# Altium schematic sheet LittleRF_Hardware.SchDoc
size OrCAD C; SheetNumber: 1; SheetTotal: 1
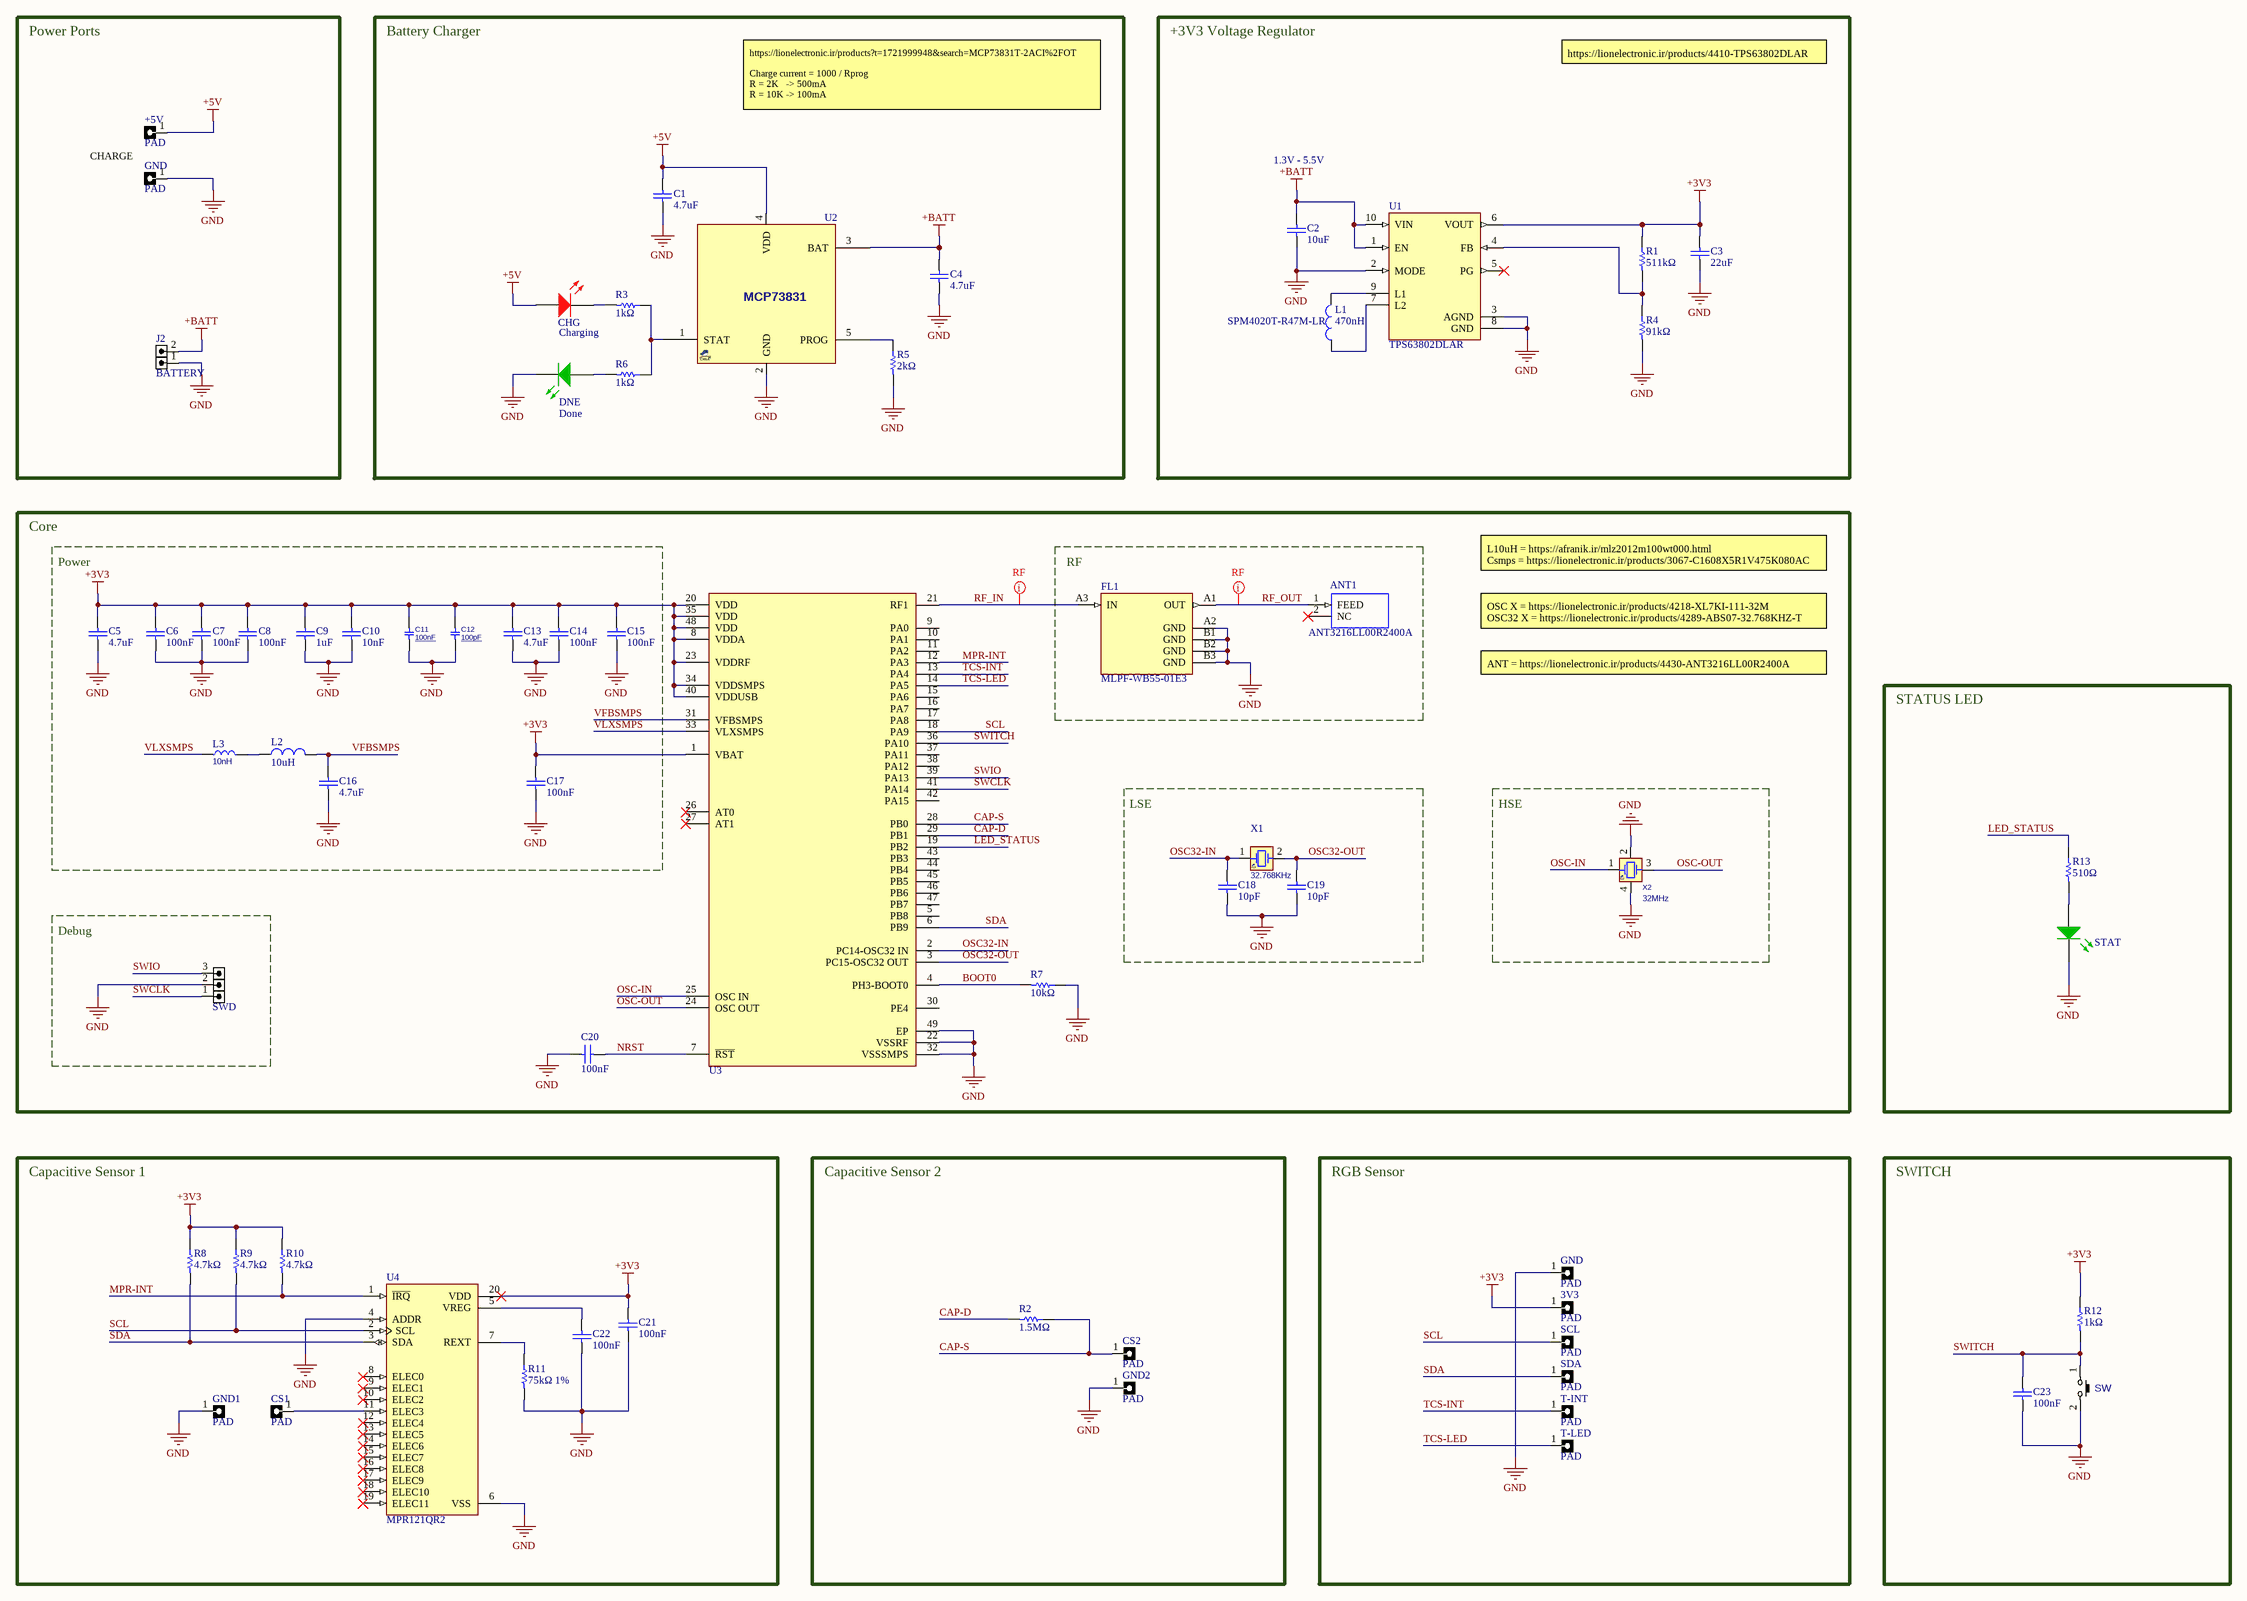
[diagram p0: LittleRF_Hardware.SchDoc]

## Parts
(Parts that share a designator on the sheet are numbered #1, #2 ... from top to bottom, then left to right.)
3V3  PAD  [HDR_F_1_Pad]
+5V  PAD  [HDR_F_1_Pad]
ANT1  ANT3216LL00R2400A  [ANTC3216X135N]
C1  4.7uF  [C0805]
C2  10uF  [C0805]
C3  22uF  [C0805]
C4  4.7uF  [C0805]
C5  4.7uF  [C0805]
C6  100nF  [C0603]
C7  100nF  [C0603]
C8  100nF  [C0603]
C9  1uF  [C0603]
C10  10nF  [C0603]
C11  100nF  [C0402]
C12  100pF  [C0402]
C13  4.7uF  [C0805]
C14  100nF  [C0603]
C15  100nF  [C0603]
C16  4.7uF  [C0805]
C17  100nF  [C0603]
C18  10pF  [C0603]
C19  10pF  [C0603]
C20  100nF  [C0603]
C21  100nF  [C0603]
C22  100nF  [C0603]
C23  100nF  [C0603]
CHG  LED-RED  [LEDSMD0603R]  (value not drawn)
CS1  PAD  [HDR_F_1_Pad]
CS2  PAD  [HDR_F_1_Pad]
DNE  LED-GREEN  [LEDSMD0603G]  (value not drawn)
FL1  MLPF-WB55-01E3  [FIL_MLPF-WB55-02E3]
GND1  PAD  [HDR_F_1_Pad]
GND2  PAD  [HDR_F_1_Pad]
GND#1  PAD  [HDR_F_1_Pad]
GND#2  PAD  [HDR_F_1_Pad]
J2  BATTERY  [HDR_M_1X2]
L1  470nH  [IND_SPM4020T-R47M-LR]
L2  10uH  [2012[0805]]
L3  10nH  [L0603]
R1  511kΩ  [1608[0603]]
R2  1.5MΩ  [1608[0603]]
R3  1kΩ  [1608[0603]]
R4  91kΩ  [1608[0603]]
R5  2kΩ  [1608[0603]]
R6  1kΩ  [1608[0603]]
R7  10kΩ  [1608[0603]]
R8  4.7kΩ  [1608[0603]]
R9  4.7kΩ  [1608[0603]]
R10  4.7kΩ  [1608[0603]]
R11  75kΩ 1%  [1608[0603]]
R12  1kΩ  [1608[0603]]
R13  510Ω  [1608[0603]]
SCL  PAD  [HDR_F_1_Pad]
SDA  PAD  [HDR_F_1_Pad]
STAT  LED-GREEN  [LEDSMD0603G]  (value not drawn)
SW  PUSHBUTTON  [SWPBS_SPDT_R_6X3X3.5]  (value not drawn)
SWD  HDRM3  [HDR_M_1X3]  (value not drawn)
T-INT  PAD  [HDR_F_1_Pad]
T-LED  PAD  [HDR_F_1_Pad]
U1  TPS63802DLAR  [VREG_TPS63802DLAR]
U2  MCP73831  [SOT23_5]  (value not drawn)
U3  STM32WB55CGU6  [STMicroelectronics_STM32WB55CGU6_IPC_B]  (value not drawn)
U4  MPR121QR2  [QFN40P300X300X60-20N]
X1  32.768KHz  [XTL_2_3215]
X2  32MHz  [XTL_4_2016]

## Blocks framed on the sheet
Power Ports: +5V GND#1 J2
Battery Charger: C1 C4 CHG DNE R3 R5 R6 U2
+3V3 Voltage Regulator: C2 C3 L1 R1 R4 U1
Core: C20 R7 U3
Power: C5-C17 L2 L3
RF: ANT1 FL1
STATUS LED: R13 STAT
LSE: C18 C19 X1
HSE: X2
Debug: SWD
Capacitive Sensor 1: C21 C22 CS1 GND1 R8-R11 U4
Capacitive Sensor 2: CS2 GND2 R2
RGB Sensor: 3V3 GND#2 SCL SDA T-INT T-LED
SWITCH: C23 R12 SW

## Nets
+3V3: 3V3.1 C3.2 C5.2 C6.2 C7.2 C8.2 C9.2 C10.2 C11.2 C12.2 C13.2 C14.2 C15.2 C17.2 C21.2 R1.1 R8.1 R9.1 R10.1 R12.1 U1.6(VOUT) U3.1(VBAT) U3.8(VDDA) U3.20(VDD) U3.23(VDDRF) U3.34(VDDSMPS) U3.35(VDD) U3.40(VDDUSB) U3.48(VDD) U4.20(VDD)
+5V: +5V.1 C1.2 CHG.1(A) U2.4(VDD)
+BATT: C2.2 C4.2 J2.2 U1.1(EN) U1.10(VIN) U2.3(BAT)
GND: C1.1 C2.1 C3.1 C4.1 C5.1 C6.1 C7.1 C8.1 C9.1 C10.1 C11.1 C12.1 C13.1 C14.1 C15.1 C16.1 C17.1 C18.1 C19.1 C20.1 C21.1 C22.1 C23.1 DNE.2(K) FL1.A2(GND) FL1.B1(GND) FL1.B2(GND) FL1.B3(GND) GND1.1 GND2.1 GND#1.1 GND#2.1 J2.1 R4.2 R5.2 R7.1 R11.2 STAT.2(K) SW.2 SWD.2 U1.2(MODE) U1.3(AGND) U1.8(GND) U2.2(GND) U3.22(VSSRF) U3.32(VSSSMPS) U3.49(EP) U4.4(ADDR) U4.6(VSS) X2.2 X2.4
BOOT0: R7.2 U3.4(PH3-BOOT0)
CAP-D: R2.2 U3.29(PB1)
CAP-S: CS2.1 R2.1 U3.28(PB0)
LED_STATUS: R13.1 U3.19(PB2)
MPR-INT: R10.2 U3.12(PA3) U4.1(~{IRQ})
NRST: C20.2 U3.7(~{RST})
OSC32-IN: C18.2 U3.2(PC14-OSC32_IN) X1.1(OSC1)
OSC32-OUT: C19.2 U3.3(PC15-OSC32_OUT) X1.2(OSC2)
OSC-IN: U3.25(OSC_IN) X2.1
OSC-OUT: U3.24(OSC_OUT) X2.3
RF_IN: FL1.A3(IN) U3.21(RF1)
RF_OUT: ANT1.1(FEED) FL1.A1(OUT)
SCL: R9.2 SCL.1 U3.18(PA9) U4.2(SCL)
SDA: R8.2 SDA.1 U3.6(PB9) U4.3(SDA)
SWCLK: SWD.1 U3.41(PA14)
SWIO: SWD.3 U3.39(PA13)
SWITCH: C23.2 R12.2 SW.1 U3.36(PA10)
TCS-INT: T-INT.1 U3.13(PA4)
TCS-LED: T-LED.1 U3.14(PA5)
VFBSMPS: C16.2 L2.2 U3.31(VFBSMPS)
VLXSMPS: L3.1 U3.33(VLXSMPS)
NetC22_2: C22.2 U4.5(VREG)
NetCHG_2: CHG.2(K) R3.2
NetCS1_1: CS1.1 U4.11(ELEC3)
NetDNE_1: DNE.1(A) R6.2
NetL1_1: L1.1 U1.7(L2)
NetL1_2: L1.2 U1.9(L1)
NetL2_1: L2.1 L3.2
NetR1_2: R1.2 R4.1 U1.4(FB)
NetR3_1: R3.1 R6.1 U2.1(STAT)
NetR5_1: R5.1 U2.5(PROG)
NetR11_1: R11.1 U4.7(REXT)
NetR13_2: R13.2 STAT.1(A)

Not connected (* = marked no-connect by the designer): ANT1 2(NC)*; U1 5(PG)*; U3 5(PB8) 9(PA0) 10(PA1) 11(PA2) 15(PA6) 16(PA7) 17(PA8) 26(AT0)* 27(AT1)* 30(PE4) 37(PA11) 38(PA12) 42(PA15) 43(PB3) 44(PB4) 45(PB5) 46(PB6) 47(PB7); U4 8(ELEC0)* 9(ELEC1)* 10(ELEC2)* 12(ELEC4)* 13(ELEC5)* 14(ELEC6)* 15(ELEC7)* 16(ELEC8)* 17(ELEC9)* 18(ELEC10)* 19(ELEC11)*

## Layout directives
net class Net_RF: RF_IN, RF_OUT

## Notes on the sheet
- https://lionelectronic.ir/products/4410-TPS63802DLAR
- https://lionelectronic.ir/products?t=1721999948&search=MCP73831T-2ACI%2FOT
  Charge current = 1000 / Rprog
  R = 2K   -> 500mA
  R = 10K -> 100mA
- CHARGE
- 1.3V - 5.5V
- Charging
- (near L1) SPM4020T-R47M-LR
- Done
- L10uH = https://afranik.ir/mlz2012m100wt000.html
  Csmps = https://lionelectronic.ir/products/3067-C1608X5R1V475K080AC
- OSC X = https://lionelectronic.ir/products/4218-XL7KI-111-32M
  OSC32 X = https://lionelectronic.ir/products/4289-ABS07-32.768KHZ-T
- ANT = https://lionelectronic.ir/products/4430-ANT3216LL00R2400A

## Library data of the parts
ANT1 = ANT3216LL00R2400A: 2.45GHz Bluetooth, ISM, Wi-Fi, Zigbeeâ„¢ Chip RF Antenna 2.4GHz ~ 2.5GHz 5.05dBi Solder Surface Mount; MF: PulseLarsen Antennas; Value: *; MP: ANT3216LL00R2400A; Package: None; Availability: In Stock; SnapEDA_Link: https://www.snapeda.com/parts/ANT3216LL00R2400A/PulseLarsen%20Antennas/view-part/5855679/?ref=snap; Price: None; Purchase-URL: https://pricing.snapeda.com/search/part/ANT3216LL00R2400A/?ref=eda; Check_prices: https://www.snapeda.com/parts/ANT3216LL00R2400A/PulseLarsen%20Antennas/view-part/5855679/?ref=eda
C1-C10 C13-C23 = CAP_SMD: CAP CER SMD 10%; Telorance: 20%; Voltage Rated: 25V; TempCo: 7XR; Supplier 1: Newark; Supplier 2: Mouser; Supplier 3: Arrow; Supplier 4: Digi-Key; Supplier Part Number 1: 66M3340; Supplier Part Number 2: 581-0805DD104KAT2A; Supplier Part Number 3: 0805DD104KAT2A; Supplier Part Number 4: 0805DD104KAT2A-ND
  C1 C4 C5 C13 C16: Value: 4.7uF
  C2: Value: 10uF
  C3: Value: 22uF
  C6-C8 C14 C15 C17 C20-C23: Value: 100nF
  C9: Value: 1uF
  C10: Value: 10nF
  C18 C19: Value: 10pF
C11 C12 = CAP_SMD_MLCC_0402: CAP, MLCC, -F, -V, MATERIAL, -%, 0201; PARAM: -, -%; MANF_P#: MANF_PART#; PRICE: 100= 1$; MANF: -; PARAM2: -V; ASSEMBLY: ASSEMBLY
  C11: VALUE: 100nF
  C12: VALUE: 100pF
CHG = LED-RED: General Propuse Ga/As LED; Supplier 1: Mouser; Supplier 2: Farnell; Supplier 3: Mouser; Supplier 4: Digi-Key; Supplier Part Number 1: 720-LHR974-LP-1; Supplier Part Number 2: 2322078; Supplier Part Number 3: 696-SML-LX0805SIC; Supplier Part Number 4: 160-1176-6-ND
DNE STAT = LED-GREEN: General Propuse Ga/As LED; Supplier 1: Newark; Supplier 2: Digi-Key; Supplier 3: Mouser; Supplier 4: Farnell; Supplier 5: Mouser; Supplier Part Number 1: 95W3800; Supplier Part Number 2: 160-1423-6-ND; Supplier Part Number 3: 630-HSMM-C170; Supplier Part Number 4: 2322076; Supplier Part Number 5: 604-APT2012SGC
FL1 = MLPF-WB55-02E3: 2.45GHz Center Frequency Low Pass RF Filter (Radio Frequency) 100MHz Bandwidth 1.2dB 6-SMD, No Lead; MF: STMicroelectronics; Purchase-URL: https://pricing.snapeda.com/search/part/MLPF-WB55-02E3/?ref=eda; Package: SMD-6 STMicroelectronics; Check_prices: https://www.snapeda.com/parts/MLPF-WB55-02E3/STMicroelectronics/view-part/5476732/?ref=eda; Value: *; MP: MLPF-WB55-02E3; Price: None; Availability: Warning; SnapEDA_Link: https://www.snapeda.com/parts/MLPF-WB55-02E3/STMicroelectronics/view-part/5476732/?ref=snap
J2 = HDR_M_1X2: CONN, HEADER, Male, pitch: 2.54mm, 2POS; VALUE: HDRM2
L1 = SPM4020T-R47M-LR: 470 nH Shielded Drum Core, Wirewound Inductor 8.7 A 11.8mOhm Max Nonstandard; MF: TDK; SnapEDA_Link: https://www.snapeda.com/parts/SPM4020T-R47M-LR/TDK/view-part/?ref=snap; Package: NON STANDARD-2 TDK; Value: *; MP: SPM4020T-R47M-LR; Check_prices: https://www.snapeda.com/parts/SPM4020T-R47M-LR/TDK/view-part/?ref=eda
L2 = Inductor: Authore: Behnam Esckandariun
L3 = IND_SMD: INDUCTOR, SMD; VALUE: 10nH
R1-R13 = Resistor_SMD: Resistor; Telorance: 5%; Power: 0.125W; Supplier 1: Digi-Key; Supplier 2: Newark; Supplier 3: Farnell; Supplier Part Number 1: 311-1.0KARCT-ND; Supplier Part Number 2: 68R0253; Supplier Part Number 3: 2413776
  R1: Value: 511kΩ
  R2: Value: 1.5MΩ
  R3 R6 R12: Value: 1kΩ
  R4: Value: 91kΩ
  R5: Value: 2kΩ
  R7: Value: 10kΩ
  R8-R10: Value: 4.7kΩ
  R11: Value: 75kΩ 1%
  R13: Value: 510Ω
SW = SWPBS_SPDT_R_6X3X3.5: SWITCH, PUSH BUTTON, TACTILE, THD, SPDT, RIGHT; MANF: C&K; PARAM: 50mA/32VDC; DESC: DESCRIPTION; MANF_P#: KMS221GLFS, KMS233GLFG; VALUE: PUSHBUTTON; ASSEMBLY: ASSEMBLY; PRICE: 0.3$
SWD = HDR_M_1X3: CONN, HEADER, Male, pitch: 2.54mm, 3POS; VALUE: HDRM3
U1 = TPS63802DLAR: 2-A, high-efficient, 11-ÂµA quiescent current buck-boost converter in QFN/DFN package; MF: Texas Instruments; Check_prices: https://www.snapeda.com/parts/TPS63802DLAR/Texas+Instruments/view-part/?ref=eda; Value: *; Availability: In Stock; MP: TPS63802DLAR; Price: None; Package: VSON-HR-10 Texas Instruments; SnapEDA_Link: https://www.snapeda.com/parts/TPS63802DLAR/Texas+Instruments/view-part/?ref=snap; Purchase-URL: https://pricing.snapeda.com/search/part/TPS63802DLAR/?ref=eda
U2 = MCP73831_SOT23-5: PWR, CHARGER, Linear, Li-Ion/Li-Po, 0.5A, 4.2v; MANF: MICROCHIP; MANF_P#: MCP73831T-2ACI/OT; PARAM2: 3.75~6Vcc, -40~85oC; PARAM: Li-Ion/Li-Po, 0.5A, 4.2v; PRICE: 4t@LION; VALUE: MCP73831
U3 = STM32WB55CGU6: IC RF TxRx + MCU 802.15.4, Bluetooth Bluetooth v5.0 2.405GHz ~ 2.48GHz 48-UFQFN Exposed Pad; Manufacturer: STMicroelectronics; Core Architecture: ARM Cortex-M4; Data Bus Width: 32bits; Frequency: 64MHz; Interface: I2C,SPI,UART,USART,2-Wire,USB,IrDA,Other; Max Junction Temp: +105°C; Max Supply Voltage: 3.6V; Memory Size: 1MBytes; Memory Type: FLASH; Min Supply Voltage: 1.71V; Number Of A/D Converters: 1; Number Of Adc Channels: 13; Number Of I/Os: 30; Number Of I2C Channels: 2; Number Of Pwm Channels: 14; Number Of Timers/Counters: 6; Ram Size: 256KBytes; Standoff Height: 0mm; Symbol Hash: 9d9ca7f3567da95c474f3f549f05e68bf9d5614707d9723cccb16a7398c4be46; Verification Version: 0.0.0.3; Datasheet Path: datasheets/IC_STMicroelectronics_STM32WB55CGU6_eec.pdf; Ambient Temperature Range High: +85°C; Ambient Temperature Range Low: -40°C; Automotive: No; ComponentLink1Description: Upverter; ComponentLink1URL: https://upverter.com/part/id/7cd8443577175ffa/; ComponentLink2Description: Datasheet; ComponentLink2URL: https://www.st.com/resource/en/datasheet/stm32wb55cg.pdf; Digikey Description: ULTRA-LOW-POWER DUAL CORE ARM CO; Digikey Part Number: 497-18489-ND; Height: 0.65mm; Lead Free: Yes; Mouser Part Number: 511-STM32WB55CGU6; Number Of Cores: 1; Number Of Spi Channels: 1; Number Of Uart Channels: 2; Number Of Usb Channels: 1; Package: UFQFPN48; Part Number: STM32WB55CGU6; RoHS: TRUE; Supplier 1: Digi-Key; Supplier 2: Mouser; Supplier Part Number 1: 497-18489-ND; Supplier Part Number 2: 511-STM32WB55CGU6; Temperature: -40°C to +105°C; Temperature Range High: +105°C; Temperature Range Low: -40°C; helpURL: https://upverter.com/part/id/7cd8443577175ffa/
U4 = MPR121QR2: Capacitive Touch Buttons, Slider, Wheel 20-QFN (3x3); MF: Resurgent Semiconductor; MP: MPR121QR2; Value: *; Check_prices: https://www.snapeda.com/parts/MPR121QR2/Resurgent/view-part/4449329/?ref=eda; SnapEDA_Link: https://www.snapeda.com/parts/MPR121QR2/Resurgent/view-part/4449329/?ref=snap; Price: None; Availability: Good; Package: UFQFN-20 Resurgent Semiconductor
X1 = XTL_2_32.768_3215E: Crystal, 32.768KHz, 6pF, 20PPM; MANF: ECS; MANF_P#: ECS-.327-CDX-1128; PARAM: -40~85oC; PARAM2: 6pF, 20PPM; PRICE: 0.6$; VALUE: 32.768KHz
X2 = XTL_4_32MHz_2016: Crystal 32MHz; MANF: MURATA; MANF_P#: XRCGB32M000FBH50R0; PARAM2: 10ppm; PARAM: 6pF; PRICE: 1= 0.3$; VALUE: 32MHz